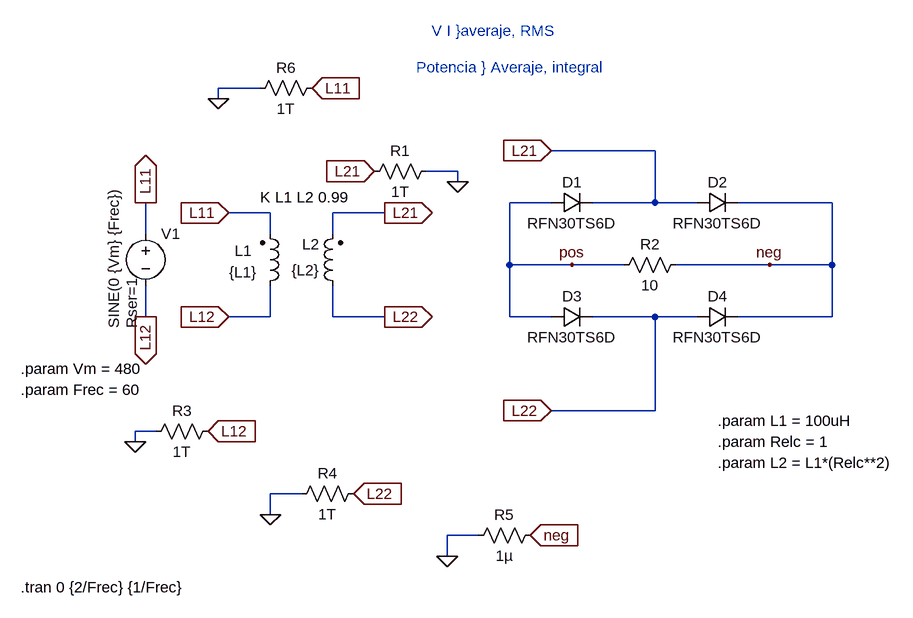
[diagram p0: schematic Draft4.asc]
Draft4.asc, the LTspice schematic file:
Version 4
SHEET 1 880 720
WIRE -1024 -64 -1088 -64
WIRE -1088 -48 -1088 -64
WIRE -416 32 -576 32
WIRE -720 64 -768 64
WIRE -720 80 -720 64
WIRE -576 112 -640 112
WIRE -416 112 -416 32
WIRE -416 112 -512 112
WIRE -352 112 -416 112
WIRE -144 112 -288 112
WIRE -1008 128 -1072 128
WIRE -832 128 -912 128
WIRE -1200 160 -1200 112
WIRE -1008 160 -1008 128
WIRE -912 160 -912 128
WIRE -640 208 -640 112
WIRE -544 208 -640 208
WIRE -464 208 -544 208
WIRE -240 208 -384 208
WIRE -144 208 -144 112
WIRE -144 208 -240 208
WIRE -1200 288 -1200 240
WIRE -1008 288 -1008 240
WIRE -1008 288 -1072 288
WIRE -912 288 -912 240
WIRE -832 288 -912 288
WIRE -640 288 -640 208
WIRE -576 288 -640 288
WIRE -416 288 -512 288
WIRE -352 288 -416 288
WIRE -144 288 -144 208
WIRE -144 288 -288 288
WIRE -416 432 -416 288
WIRE -416 432 -576 432
WIRE -1184 464 -1216 464
WIRE -1216 480 -1216 464
WIRE -960 560 -1008 560
WIRE -1008 592 -1008 560
WIRE -688 624 -736 624
WIRE -736 656 -736 624
FLAG -1200 112 L11
IOPIN -1200 112 Out
FLAG -1200 288 L12
IOPIN -1200 288 Out
FLAG -720 80 0
FLAG -848 64 L21
IOPIN -848 64 In
FLAG -1072 128 L11
IOPIN -1072 128 In
FLAG -1072 288 L12
IOPIN -1072 288 In
FLAG -832 128 L21
IOPIN -832 128 Out
FLAG -832 288 L22
IOPIN -832 288 Out
FLAG -576 32 L21
IOPIN -576 32 In
FLAG -576 432 L22
IOPIN -576 432 In
FLAG -1216 480 0
FLAG -1008 592 0
FLAG -736 656 0
FLAG -1104 464 L12
IOPIN -1104 464 In
FLAG -880 560 L22
IOPIN -880 560 In
FLAG -544 208 pos
FLAG -240 208 neg
FLAG -608 624 neg
IOPIN -608 624 In
FLAG -1088 -48 0
FLAG -944 -64 L11
IOPIN -944 -64 In
SYMBOL voltage -1200 144 R0
WINDOW 3 -49 162 VLeft 2
WINDOW 123 0 0 Left 2
WINDOW 39 -21 162 VLeft 2
SYMATTR Value SINE(0 {Vm} {Frec})
SYMATTR SpiceLine Rser=1
SYMATTR InstName V1
SYMBOL ind2 -1024 256 M180
WINDOW 0 -39 70 Left 2
WINDOW 3 -47 37 Left 2
SYMATTR InstName L1
SYMATTR Value {L1}
SYMATTR Type ind
SYMBOL ind2 -896 256 R180
WINDOW 0 36 80 Left 2
WINDOW 3 36 40 Left 2
SYMATTR InstName L2
SYMATTR Value {L2}
SYMATTR Type ind
SYMBOL res -864 80 R270
WINDOW 0 32 56 VTop 2
WINDOW 3 0 56 VBottom 2
SYMATTR InstName R1
SYMATTR Value 1T
SYMBOL diode -576 128 R270
WINDOW 0 32 32 VTop 2
WINDOW 3 0 32 VBottom 2
SYMATTR InstName D1
SYMATTR Value RFN30TS6D
SYMBOL diode -352 128 R270
WINDOW 0 32 32 VTop 2
WINDOW 3 0 32 VBottom 2
SYMATTR InstName D2
SYMATTR Value RFN30TS6D
SYMBOL diode -576 304 R270
WINDOW 0 32 32 VTop 2
WINDOW 3 0 32 VBottom 2
SYMATTR InstName D3
SYMATTR Value RFN30TS6D
SYMBOL diode -352 304 R270
WINDOW 0 32 32 VTop 2
WINDOW 3 0 32 VBottom 2
SYMATTR InstName D4
SYMATTR Value RFN30TS6D
SYMBOL res -480 224 R270
WINDOW 0 32 56 VTop 2
WINDOW 3 0 56 VBottom 2
SYMATTR InstName R2
SYMATTR Value 10
SYMBOL res -1088 448 R90
WINDOW 0 0 56 VBottom 2
WINDOW 3 32 56 VTop 2
SYMATTR InstName R3
SYMATTR Value 1T
SYMBOL res -864 544 R90
WINDOW 0 0 56 VBottom 2
WINDOW 3 32 56 VTop 2
SYMATTR InstName R4
SYMATTR Value 1T
SYMBOL res -592 608 R90
WINDOW 0 0 56 VBottom 2
WINDOW 3 32 56 VTop 2
SYMATTR InstName R5
SYMATTR Value 1µ
SYMBOL res -928 -80 R90
WINDOW 0 0 56 VBottom 2
WINDOW 3 32 56 VTop 2
SYMATTR InstName R6
SYMATTR Value 1T
TEXT -1024 104 Left 2 !K L1 L2 0.99
TEXT -320 448 Left 2 !.param L1 = 100uH
TEXT -320 480 Left 2 !.param Relc = 1
TEXT -320 512 Left 2 !.param L2 = L1*(Relc**2)
TEXT -1392 368 Left 2 !.param Vm = 480
TEXT -1392 400 Left 2 !.param Frec = 60
TEXT -1392 704 Left 2 !.tran 0 {2/Frec} {1/Frec}
TEXT -760 -152 Left 2 ;V I }averaje, RMS
TEXT -784 -96 Left 2 ;Potencia } Averaje, integral

The netlist it stands for:
* Draft4.asc
V1 L11 L12 SINE(0 {Vm} {Frec}) Rser=1
L1 L12 L11 {L1}
L2 L22 L21 {L2}
R1 L21 0 1T
D1 pos L21 RFN30TS6D
D2 L21 neg RFN30TS6D
D3 pos L22 RFN30TS6D
D4 L22 neg RFN30TS6D
R2 pos neg 10
R3 L12 0 1T
R4 L22 0 1T
R5 neg 0 1µ
R6 L11 0 1T
.model D D
.lib standard.dio
K L1 L2 0.99
.param L1 = 100uH
.param Relc = 1
.param L2 = L1*(Relc**2)
.param Vm = 480
.param Frec = 60
.tran 0 {2/Frec} {1/Frec}
* V I }averaje, RMS
* Potencia } Averaje, integral
.backanno
.end